# Altium schematic sheet 02_MCU.SchDoc
size A4
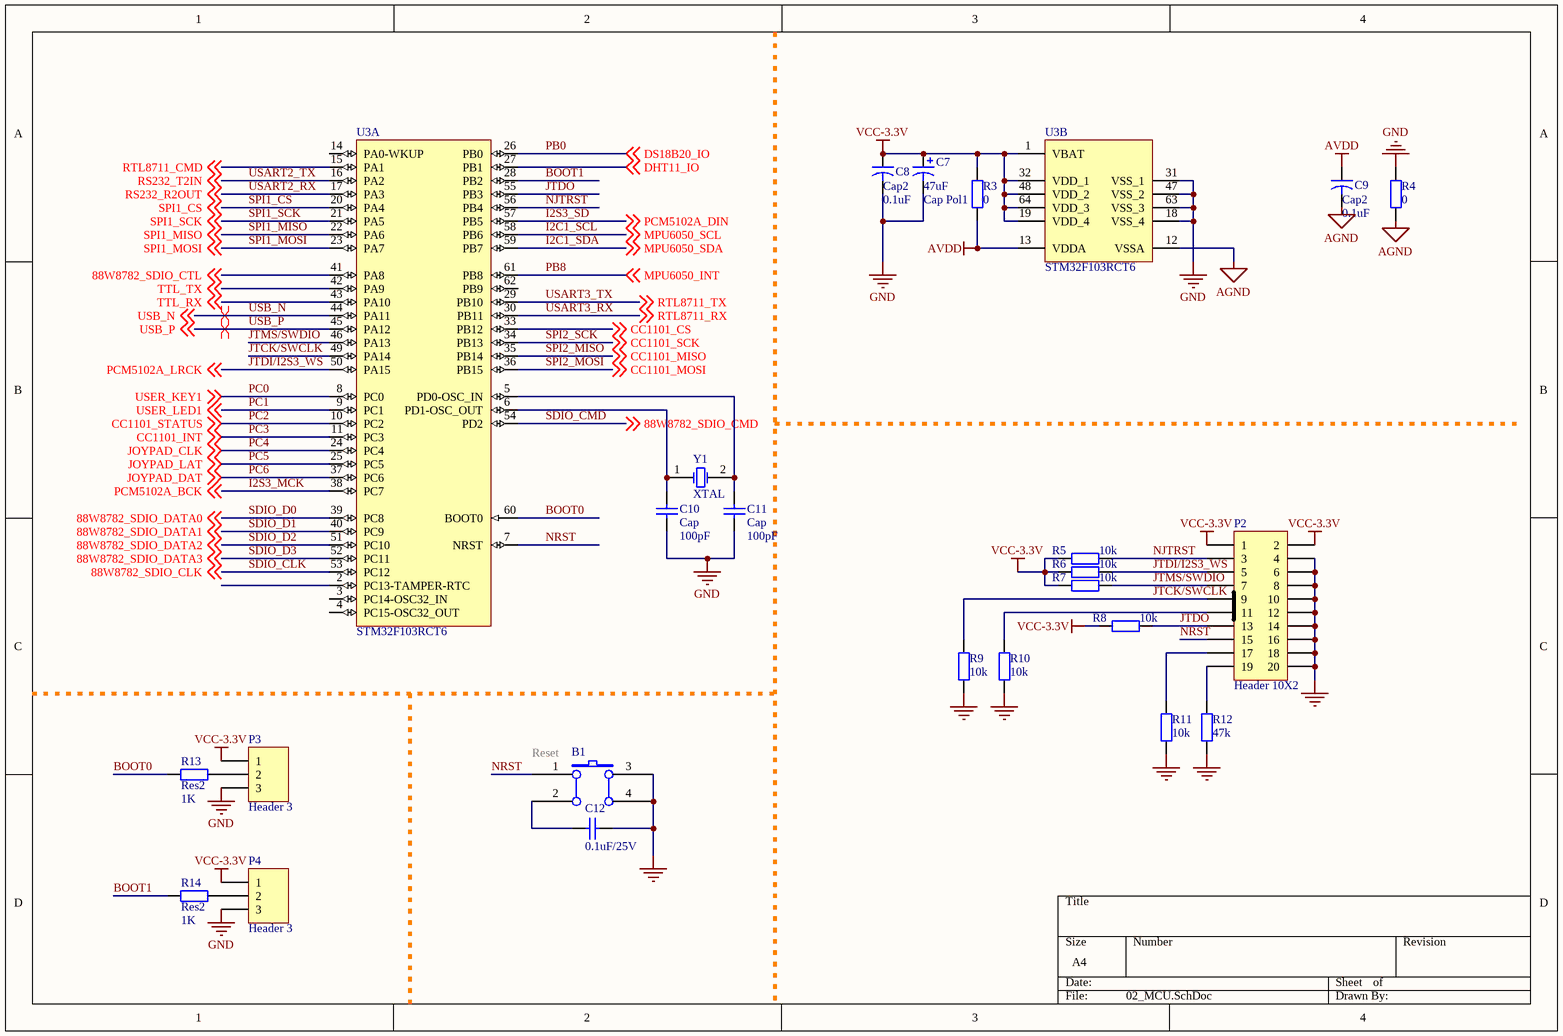
[diagram p0: 02_MCU.SchDoc]

## Parts
B1  Reset  [SWITCH-0.65/0.45]
C7  Cap Pol1  value 47uF  [RB2.5-6.3]
C8  Cap2  value 0.1uF  [CAPR5-4X5]
C9  Cap2  value 0.1uF  [RAD-0.1]
C10  Cap  value 100pF  [RAD-0.1]
C11  Cap  value 100pF  [RAD-0.1]
C12  0.1uF/25V  [RAD-0.1]
P2  Header 10X2  [MHDR2X10_2.54]
P3  Header 3  [HDR1X3]
P4  Header 3  [HDR1X3]
R3  value 0  [AXIAL-0.3]
R4  value 0  [AXIAL-0.3]  (hidden comment: 10k)
R5  10k  [AXIAL-0.3]
R6  10k  [AXIAL-0.3]
R7  10k  [AXIAL-0.3]
R8  10k  [AXIAL-0.3]
R9  10k  [AXIAL-0.3]
R10  10k  [AXIAL-0.3]
R11  10k  [AXIAL-0.3]
R12  value 47k  [AXIAL-0.3]  (hidden comment: 10k)
R13  Res2  value 1K  [AXIAL-0.3]
R14  Res2  value 1K  [AXIAL-0.3]
U3  STM32F103RCT6  [STM-LQFP64_M]  (parts A,B of 2)
Y1  XTAL  [XTAL1]

## Nets
AGND: C9.2 R4.1 U3.12(VSSA)
AVDD: C9.1 R3.1 U3.13(VDDA)
GND: B1.3(B1) B1.4(A1) C7.2 C8.2 C10.1 C11.1 C12.1 P2.4 P2.6 P2.8 P2.10 P2.12 P2.14 P2.16 P2.18 P2.20 P3.3 P4.3 R4.2 R9.1 R10.1 R11.1 R12.1 U3.18(VSS_4) U3.31(VSS_1) U3.47(VSS_2) U3.63(VSS_3)
VCC-3.3V: C7.1 C8.1 P2.1 P2.2 P3.1 P4.1 R3.2 R5.1 R6.1 R7.1 R8.1 U3.1(VBAT) U3.19(VDD_4) U3.32(VDD_1) U3.48(VDD_2) U3.64(VDD_3)
88W8782_SDIO_CTL: U3.41(PA8) ; off-sheet 88W8782_SDIO_CTL
BOOT0: R13.1 U3.60(BOOT0)
BOOT1: R14.1 U3.28(PB2)
CC1101_CS: U3.33(PB12) ; off-sheet CC1101_CS
DHT11_IO: U3.27(PB1) ; off-sheet DHT11_IO
I2C1_SCL: U3.58(PB6) ; off-sheet MPU6050_SCL  [also labelled MPU6050_SCL]
I2C1_SDA: U3.59(PB7) ; off-sheet MPU6050_SDA  [also labelled MPU6050_SDA]
I2S3_MCK: U3.38(PC7) ; off-sheet PCM5102A_BCK  [also labelled PCM5102A_BCK]
I2S3_SD: U3.57(PB5) ; off-sheet PCM5102A_DIN  [also labelled PCM5102A_DIN]
JTCK/SWCLK: P2.9 R9.2 U3.49(PA14)
JTDI/I2S3_WS: P2.5 R6.2 U3.50(PA15) ; off-sheet PCM5102A_LRCK  [also labelled PCM5102A_LRCK]
JTDO: P2.13 R8.2 U3.55(PB3)
JTMS/SWDIO: P2.7 R7.2 U3.46(PA13)
NJTRST: P2.3 R5.2 U3.56(PB4)
NRST: B1.1(A0) P2.15 U3.7(NRST)
PB0: U3.26(PB0) ; off-sheet DS18B20_IO  [also labelled DS18B20_IO]
PB8: U3.61(PB8) ; off-sheet MPU6050_INT  [also labelled MPU6050_INT]
PC0: U3.8(PC0) ; off-sheet USER_KEY1  [also labelled USER_KEY1]
PC1: U3.9(PC1) ; off-sheet USER_LED1  [also labelled USER_LED1]
PC2: U3.10(PC2) ; off-sheet CC1101_STATUS  [also labelled CC1101_STATUS]
PC3: U3.11(PC3) ; off-sheet CC1101_INT  [also labelled CC1101_INT]
PC4: U3.24(PC4) ; off-sheet JOYPAD_CLK  [also labelled JOYPAD_CLK]
PC5: U3.25(PC5) ; off-sheet JOYPAD_LAT  [also labelled JOYPAD_LAT]
PC6: U3.37(PC6) ; off-sheet JOYPAD_DAT  [also labelled JOYPAD_DAT]
RTL8711_CMD: U3.15(PA1) ; off-sheet RTL8711_CMD
SDIO_CLK: U3.53(PC12) ; off-sheet 88W8782_SDIO_CLK  [also labelled 88W8782_SDIO_CLK]
SDIO_CMD: U3.54(PD2) ; off-sheet 88W8782_SDIO_CMD  [also labelled 88W8782_SDIO_CMD]
SDIO_D0: U3.39(PC8) ; off-sheet 88W8782_SDIO_DATA0  [also labelled 88W8782_SDIO_DATA0]
SDIO_D1: U3.40(PC9) ; off-sheet 88W8782_SDIO_DATA1  [also labelled 88W8782_SDIO_DATA1]
SDIO_D2: U3.51(PC10) ; off-sheet 88W8782_SDIO_DATA2  [also labelled 88W8782_SDIO_DATA2]
SDIO_D3: U3.52(PC11) ; off-sheet 88W8782_SDIO_DATA3  [also labelled 88W8782_SDIO_DATA3]
SPI1_CS: U3.20(PA4) ; off-sheet SPI1_CS
SPI1_MISO: U3.22(PA6) ; off-sheet SPI1_MISO
SPI1_MOSI: U3.23(PA7) ; off-sheet SPI1_MOSI
SPI1_SCK: U3.21(PA5) ; off-sheet SPI1_SCK
SPI2_MISO: U3.35(PB14) ; off-sheet CC1101_MISO  [also labelled CC1101_MISO]
SPI2_MOSI: U3.36(PB15) ; off-sheet CC1101_MOSI  [also labelled CC1101_MOSI]
SPI2_SCK: U3.34(PB13) ; off-sheet CC1101_SCK  [also labelled CC1101_SCK]
TTL_RX: U3.43(PA10) ; off-sheet TTL_RX
TTL_TX: U3.42(PA9) ; off-sheet TTL_TX
USART2_RX: U3.17(PA3) ; off-sheet RS232_R2OUT  [also labelled RS232_R2OUT]
USART2_TX: U3.16(PA2) ; off-sheet RS232_T2IN  [also labelled RS232_T2IN]
USART3_RX: U3.30(PB11) ; off-sheet RTL8711_RX  [also labelled RTL8711_RX]
USART3_TX: U3.29(PB10) ; off-sheet RTL8711_TX  [also labelled RTL8711_TX]
USB_N: U3.44(PA11) ; off-sheet USB_N
USB_P: U3.45(PA12) ; off-sheet USB_P
NetB1_2: B1.2(B0) C12.2
NetC10_2: C10.2 U3.6(PD1-OSC_OUT) Y1.1(OSC1)
NetC11_2: C11.2 U3.5(PD0-OSC_IN) Y1.2(OSC2)
NetP2_11: P2.11 R10.2
NetP2_17: P2.17 R11.2
NetP2_19: P2.19 R12.2
NetP3_2: P3.2 R13.2
NetP4_2: P4.2 R14.2

Not connected (* = marked no-connect by the designer): U3 2(PC13-TAMPER-RTC) 3(PC14-OSC32_IN) 4(PC15-OSC32_OUT) 14(PA0-WKUP) 62(PB9)

## Layout directives
differential pair: USB_N, USB_P

## Notes on the sheet
- Power
- Boot
- Reset
- JTAG

## Library data of the parts
B1 = SW PUSHBUTTON: Tactile Switch
C7 = Cap Pol1: Polarized Capacitor (Radial); Published: 8-Jun-2000; LatestRevisionDate: 17-Jul-2002; LatestRevisionNote: Re-released for DXP Platform.; PackageReference: RB7.6-15; Publisher: Altium Limited; PackageDescription: Polarized Capacitor (Radial); 2 Leads
C8 C9 = Cap2: Capacitor; Published: 23-Sep-2002; PackageReference: CAPR5-4X5; Publisher: Altium Limited; PackageDescription: Capacitor; 2 Leads
C10 C11 = Cap: Capacitor; Published: 8-Jun-2000; LatestRevisionDate: 17-Jul-2002; LatestRevisionNote: Re-released for DXP Platform.; PackageReference: RAD-0.3; Publisher: Altium Limited; PackageDescription: Radial Cap, Thru-Hole; 2 Leads; 0.3 in Pin Spacing
C12 = CAP: Capacitor; Value: 100pF; Published: 8-Jun-2000; Revision: July-2002: Re-released for DXP Platform.; Publisher: Altium Limited
P2 = Header 10X2: Header, 10-Pin, Dual row; LatestRevisionDate: 17-Jul-2002; LatestRevisionNote: Re-released for DXP Platform.; Publisher: Altium Limited
P3 P4 = Header 3: Header, 3-Pin; LatestRevisionDate: 17-Jul-2002; LatestRevisionNote: Re-released for DXP Platform.; Publisher: Altium Limited
R3-R12 = Res1: 贴片电阻; Published: 8-Jun-2000; LatestRevisionDate: 17-Jul-2002; LatestRevisionNote: Re-released for DXP Platform.; PackageReference: AXIAL-0.4; Publisher: Altium Limited
  R5-R11: Value: 10k
R13 R14 = Res2: Resistor; Published: 8-Jun-2000; LatestRevisionDate: 17-Jul-2002; LatestRevisionNote: Re-released for DXP Platform.; PackageReference: AXIAL-0.4; Publisher: Altium Limited; PackageDescription: Axial Device, Thru-Hole; 2 Leads; 0.4 in Pin Spacing
U3 = STM32F103RCT6: ARM Cortex-M3 32-bit MCU, 256 KB Flash, 48 KB Internal RAM, 51 I/Os, 64-pin LQFP, -40 to 85 degC, Tray; A/D Converter: 3x12-bit (16 Channel); D/A Converter: 2x12-bit (2 Channel); FLASH Size (Prog) (kB): 256; I/Os (High Current): 51; Internal RAM Size (kB): 48; Operating Frequency(F) (Processor speed) (MHz): 72; Supply Voltage(Vcc) min (V): 2; DatasheetVersion: Rev. 8; PackageVersion: Rev. 4, 06/2013; PackageReference: LQFP64; PackageDescription: 64-Pin Low Profile Quad Flat Package, 10 x 10 mm Body, 0.5 mm Pitch; Supplier 1: Digi-Key; Supplier Part Number 1: 497-9033-ND; Supplier 2: Newark; Supplier Part Number 2: 01P4099; Supplier 3: Newark; Supplier Part Number 3: 57P1227; Supplier 4: Mouser; Supplier Part Number 4: 511-STM32F103RCT6; Core: ARM Cortex-M3; Packing: Tray; Mounting Technology: Surface Mount; PartNumber: STM32F103RCT6; ComponentLink1Description: Manufacturer URL; ComponentLink1URL: http://www.st.com/web/en/home.html; ComponentLink2Description: Datasheet; ComponentLink2URL: http://www.st.com/st-web-ui/static/active/en/resource/technical/document/datasheet/CD00191185.pdf; ComponentLink3Description: Package Specification; ComponentLink3URL: http://www.st.com/st-web-ui/static/active/en/resource/technical/document/datasheet/DM00037051.pdf
Y1 = XTAL: Crystal Oscillator; Published: 8-Jun-2000; LatestRevisionDate: 17-Jul-2002; LatestRevisionNote: Re-released for DXP Platform.; PackageReference: R38; Publisher: Altium Limited; PackageDescription: Crystal, Thru-Hole; 2 Leads; Body 3.1 x 8.2 mm (Dia.xH)